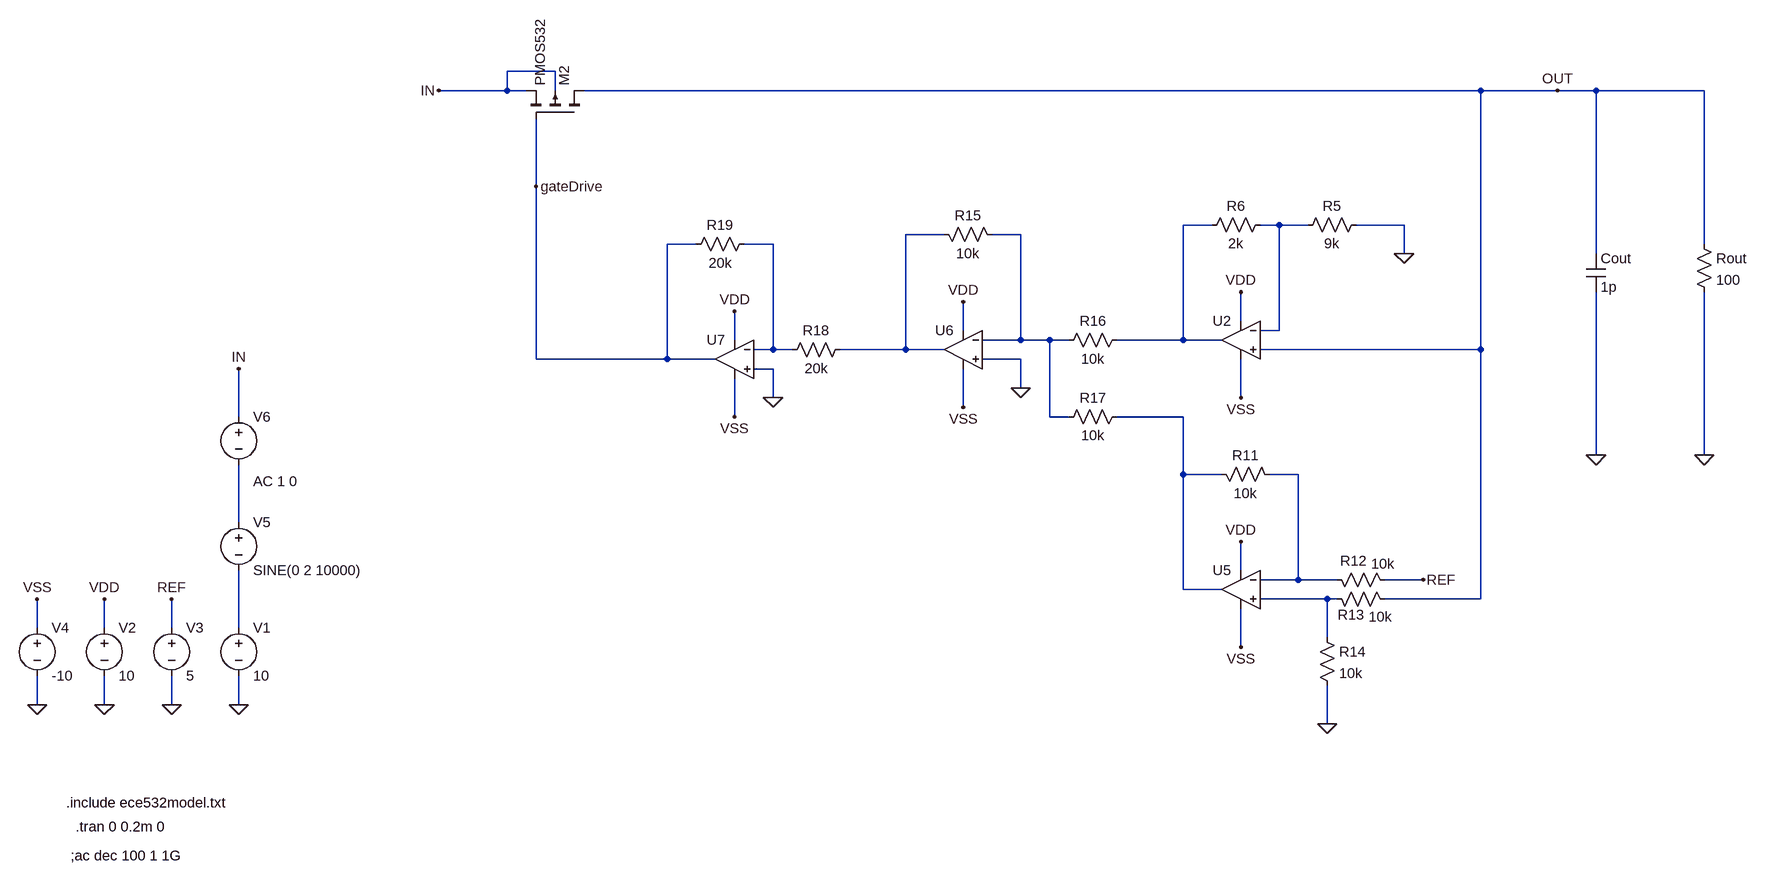
[diagram p0: schematic LDO_v3_compensated_feedback_reduced.asc]
LDO_v3_compensated_feedback_reduced.asc, the LTspice schematic file:
Version 4
SHEET 1 3668 1416
WIRE -272 64 -352 64
WIRE -352 96 -352 64
WIRE -352 96 -656 96
WIRE -320 96 -352 96
WIRE -272 96 -272 64
WIRE 1424 96 -224 96
WIRE 1552 96 1424 96
WIRE 1616 96 1552 96
WIRE 1808 96 1616 96
WIRE -304 256 -304 144
WIRE 976 320 928 320
WIRE 1088 320 1056 320
WIRE 1136 320 1088 320
WIRE 1296 320 1216 320
WIRE 496 336 432 336
WIRE 624 336 576 336
WIRE 48 352 0 352
WIRE 176 352 128 352
WIRE 1808 352 1808 96
WIRE 1296 368 1296 320
WIRE 1616 368 1616 96
WIRE 1024 480 1024 432
WIRE 528 496 528 448
WIRE 1088 496 1088 320
WIRE 1088 496 1056 496
WIRE 112 512 112 464
WIRE 624 512 624 336
WIRE 624 512 560 512
WIRE 672 512 624 512
WIRE 704 512 672 512
WIRE 928 512 928 320
WIRE 928 512 784 512
WIRE 992 512 928 512
WIRE 176 528 176 352
WIRE 176 528 144 528
WIRE 208 528 176 528
WIRE 432 528 432 336
WIRE 432 528 288 528
WIRE 496 528 432 528
WIRE 1424 528 1424 96
WIRE 1424 528 1056 528
WIRE -304 544 -304 256
WIRE 0 544 0 352
WIRE 0 544 -304 544
WIRE 80 544 0 544
WIRE 624 544 560 544
WIRE 176 560 144 560
WIRE 624 592 624 544
WIRE 176 608 176 560
WIRE 1024 608 1024 544
WIRE 528 624 528 560
WIRE -1056 640 -1056 560
WIRE 112 640 112 576
WIRE 672 640 672 512
WIRE 704 640 672 640
WIRE 928 640 784 640
WIRE 1616 704 1616 432
WIRE 1808 704 1808 432
WIRE 928 736 928 640
WIRE 992 736 928 736
WIRE 1120 736 1072 736
WIRE -1056 816 -1056 720
WIRE 1024 896 1024 848
WIRE 1120 912 1120 736
WIRE 1120 912 1056 912
WIRE 1184 912 1120 912
WIRE 1328 912 1264 912
WIRE 928 928 928 736
WIRE 992 928 928 928
WIRE 1168 944 1056 944
WIRE 1184 944 1168 944
WIRE 1424 944 1424 528
WIRE 1424 944 1264 944
WIRE -1392 992 -1392 944
WIRE -1280 992 -1280 944
WIRE -1168 992 -1168 944
WIRE -1056 992 -1056 896
WIRE 1168 1008 1168 944
WIRE 1024 1024 1024 960
WIRE -1392 1120 -1392 1072
WIRE -1280 1120 -1280 1072
WIRE -1168 1120 -1168 1072
WIRE -1056 1120 -1056 1072
WIRE 1168 1152 1168 1088
FLAG 1616 704 0
FLAG -1280 1120 0
FLAG -1280 944 VDD
FLAG 1808 704 0
FLAG -304 256 gateDrive
FLAG -1168 1120 0
FLAG 1024 432 VDD
FLAG 1024 608 VSS
FLAG 1552 96 OUT
FLAG -1168 944 REF
FLAG -1392 1120 0
FLAG -1392 944 VSS
FLAG -1056 1120 0
FLAG -656 96 IN
FLAG -1056 560 IN
FLAG 1168 1152 0
FLAG 1024 848 VDD
FLAG 1024 1024 VSS
FLAG 528 448 VDD
FLAG 528 624 VSS
FLAG 624 592 0
FLAG 112 464 VDD
FLAG 112 640 VSS
FLAG 176 608 0
FLAG 1328 912 REF
FLAG 1296 368 0
SYMBOL cap 1600 368 R0
SYMATTR InstName Cout
SYMATTR Value 1p
SYMBOL voltage -1280 976 R0
WINDOW 123 0 0 Left 2
WINDOW 39 0 0 Left 2
SYMATTR InstName V2
SYMATTR Value 10
SYMBOL res 1792 336 R0
SYMATTR InstName Rout
SYMATTR Value 100
SYMBOL voltage -1168 976 R0
WINDOW 123 0 0 Left 2
WINDOW 39 0 0 Left 2
SYMATTR InstName V3
SYMATTR Value 5
SYMBOL Opamps\\UniversalOpamp2 1024 512 M0
SYMATTR InstName U2
SYMBOL res 1120 336 R270
WINDOW 0 32 56 VTop 2
WINDOW 3 0 56 VBottom 2
SYMATTR InstName R5
SYMATTR Value 9k
SYMBOL res 960 336 R270
WINDOW 0 32 56 VTop 2
WINDOW 3 0 56 VBottom 2
SYMATTR InstName R6
SYMATTR Value 2k
SYMBOL voltage -1392 976 R0
WINDOW 123 0 0 Left 2
WINDOW 39 0 0 Left 2
SYMATTR InstName V4
SYMATTR Value -10
SYMBOL pmos4 -224 144 M270
SYMATTR InstName M2
SYMATTR Value PMOS532
SYMATTR Value2 l=1u w=1000u m=1
SYMBOL voltage -1056 976 R0
WINDOW 123 0 0 Left 2
WINDOW 39 0 0 Left 2
SYMATTR InstName V1
SYMATTR Value 10
SYMBOL voltage -1056 800 R0
WINDOW 123 0 0 Left 2
WINDOW 39 0 0 Left 2
SYMATTR InstName V5
SYMATTR Value SINE(0 2 10000)
SYMBOL voltage -1056 624 R0
WINDOW 123 24 124 Left 2
WINDOW 39 0 0 Left 2
SYMATTR Value2 AC 1 0
SYMATTR InstName V6
SYMATTR Value ""
SYMBOL res 976 720 M90
WINDOW 0 0 56 VBottom 2
WINDOW 3 32 56 VTop 2
SYMATTR InstName R11
SYMATTR Value 10k
SYMBOL res 1168 896 M90
WINDOW 0 0 44 VBottom 2
WINDOW 3 -26 93 VTop 2
SYMATTR InstName R12
SYMATTR Value 10k
SYMBOL res 1168 928 M90
WINDOW 0 58 40 VBottom 2
WINDOW 3 30 89 VTop 2
SYMATTR InstName R13
SYMATTR Value 10k
SYMBOL res 1152 992 R0
SYMATTR InstName R14
SYMATTR Value 10k
SYMBOL Opamps\\UniversalOpamp2 1024 928 M0
SYMATTR InstName U5
SYMBOL res 480 320 M90
WINDOW 0 0 56 VBottom 2
WINDOW 3 32 56 VTop 2
SYMATTR InstName R15
SYMATTR Value 10k
SYMBOL Opamps\\UniversalOpamp2 528 528 M0
SYMATTR InstName U6
SYMBOL res 688 528 R270
WINDOW 0 32 56 VTop 2
WINDOW 3 0 56 VBottom 2
SYMATTR InstName R16
SYMATTR Value 10k
SYMBOL res 688 656 R270
WINDOW 0 32 56 VTop 2
WINDOW 3 0 56 VBottom 2
SYMATTR InstName R17
SYMATTR Value 10k
SYMBOL Opamps\\UniversalOpamp2 112 544 M0
SYMATTR InstName U7
SYMBOL res 192 544 R270
WINDOW 0 32 56 VTop 2
WINDOW 3 0 56 VBottom 2
SYMATTR InstName R18
SYMATTR Value 20k
SYMBOL res 32 368 R270
WINDOW 0 32 56 VTop 2
WINDOW 3 0 56 VBottom 2
SYMATTR InstName R19
SYMATTR Value 20k
TEXT -1344 1312 Left 2 !.include ece532model.txt
TEXT -1328 1352 Left 2 !.tran 0 0.2m 0
TEXT -1336 1400 Left 2 !;ac dec 100 1 1G

The netlist it stands for:
* LDO_v3_compensated_feedback_reduced.asc
Cout OUT 0 1p
V2 VDD 0 10
Rout OUT 0 100
V3 REF 0 5
XU2 OUT N002 VDD VSS N001 level.2 Avol=1Meg GBW=10Meg Slew=10Meg ilimit=25m rail=0 Vos=0 phimargin=45 en=0 enk=0 in=0 ink=0 Rin=500Meg  ; pins IN+ IN- V+ V- OUT
R5 N002 0 9k
R6 N001 N002 2k
V4 VSS 0 -10
M2 OUT gateDrive IN IN PMOS532 l=1u w=1000u m=1
V1 N010 0 10
V5 N008 N010 SINE(0 2 10000)
V6 IN N008 AC 1 0
R11 N006 N007 10k
R12 N007 REF 10k
R13 N009 OUT 10k
R14 N009 0 10k
XU5 N009 N007 VDD VSS N006 level.2 Avol=1Meg GBW=10Meg Slew=10Meg ilimit=25m rail=0 Vos=0 phimargin=45 en=0 enk=0 in=0 ink=0 Rin=500Meg  ; pins IN+ IN- V+ V- OUT
R15 N003 N004 10k
XU6 0 N004 VDD VSS N003 level.2 Avol=1Meg GBW=10Meg Slew=10Meg ilimit=25m rail=0 Vos=0 phimargin=45 en=0 enk=0 in=0 ink=0 Rin=500Meg  ; pins IN+ IN- V+ V- OUT
R16 N004 N001 10k
R17 N004 N006 10k
XU7 0 N005 VDD VSS gateDrive level.2 Avol=1Meg GBW=10Meg Slew=10Meg ilimit=25m rail=0 Vos=0 phimargin=45 en=0 enk=0 in=0 ink=0 Rin=500Meg  ; pins IN+ IN- V+ V- OUT
R18 N005 N003 20k
R19 gateDrive N005 20k
.model NMOS NMOS
.model PMOS PMOS
.lib standard.mos
.include ece532model.txt
.tran 0 0.2m 0
;ac dec 100 1 1G
.lib UniversalOpamps2.sub
.backanno
.end